# EAGLE design Bus_Isolator (EAGLE 6.6.0)
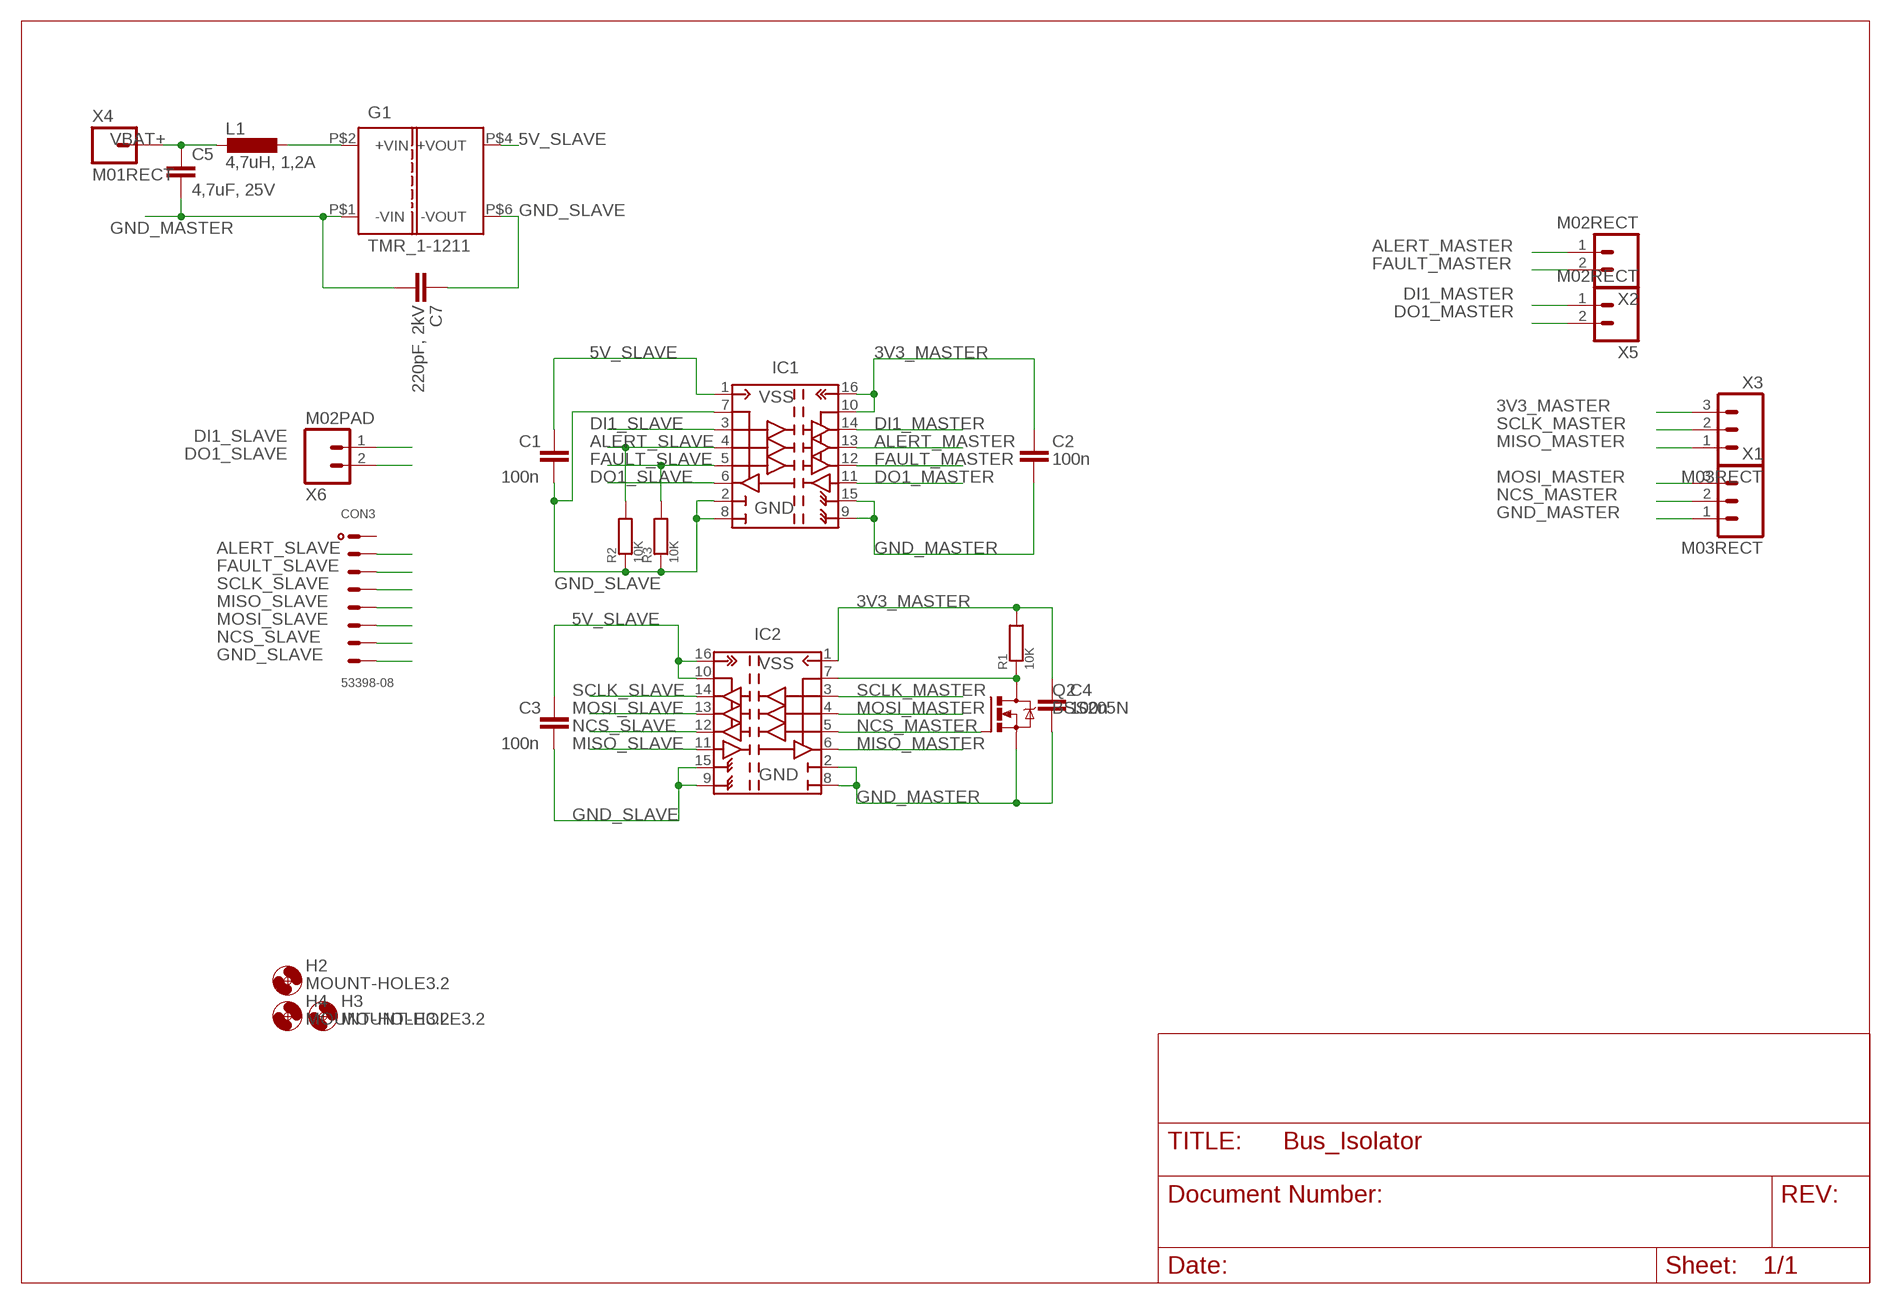
[diagram p0: schematic, sheet 1]

## Parts
C1  100n  CSTD  [C0805]
C2  100n  CSTD  [C0805]
C3  100n  CSTD  [C0805]
C4  100n  CSTD  [C0805]
C5  4,7uF, 25V  C-EUC0805  [C0805]
C7  220pF, 2kV  CC1210_HV  [C1210_HV]
CON3  53398-08  [53398-08]
G1  TMR_1-1211  TMR_1-1  [TMR_1-??1?]
H2  MOUNT-HOLE3.2  [3,2]
H3  MOUNT-HOLE3.2  [3,2]
H4  MOUNT-HOLE3.2  [3,2]
IC1  ISO7241  [R-PDSO-G16]
IC2  ISO7241  [R-PDSO-G16]
L1  4,7uH, 1,2A  L-EUL3225M  [L3225M]
Q2  BSS205N  [SOT23]
R1  10K  R0603  [R0603]
R2  10K  R  [R0805]
R3  10K  R  [R0805]
X1  M03RECT  [1X03_RECT]
X2  M02RECT  [1X02_RECT]
X3  M03RECT  [1X03_RECT]
X4  M01RECT  [1X01_RECT]
X5  M02RECT  [1X02_RECT]
X6  M02PAD  [1X02]

## Nets
3V3_MASTER: C2.2 C4.2 IC1.10(EN2) IC1.16(VCC2) IC2.1(VCC1) R1.2 X3.3
5V_SLAVE: C1.2 C3.2 G1.P$4(+VOUT) IC1.1(VCC1) IC2.10(EN2) IC2.16(VCC2)
ALERT_MASTER: IC1.13(OUT_B) X2.1
ALERT_SLAVE: CON3.2 IC1.4(IN_B) R2.2
DI1_MASTER: IC1.14(OUT_A) X5.1
DI1_SLAVE: IC1.3(IN_A) X6.1
DO1_MASTER: IC1.11(IN_D) X5.2
DO1_SLAVE: IC1.6(OUT_D) X6.2
FAULT_MASTER: IC1.12(OUT_C) X2.2
FAULT_SLAVE: CON3.3 IC1.5(IN_C) R3.2
GND_MASTER: C2.1 C4.1 C5.2 C7.P$1 G1.P$1(-VIN) IC1.9(GND22) IC1.15(GND21) IC2.2(GND11) IC2.8(GND12) Q2.2(S) X1.1
GND_SLAVE: C1.1 C3.1 C7.P$2 CON3.8 G1.P$6(-VOUT) IC1.2(GND11) IC1.7(EN1) IC1.8(GND12) IC2.9(GND22) IC2.15(GND21) R2.1 R3.1
MISO_MASTER: IC2.6(OUT_D) X3.1
MISO_SLAVE: CON3.5 IC2.11(IN_D)
MOSI_MASTER: IC2.4(IN_B) X1.3
MOSI_SLAVE: CON3.6 IC2.13(OUT_B)
N$2: IC2.7(EN1) Q2.3(D) R1.1
N$5: G1.P$2(+VIN) L1.1
NCS_MASTER: IC2.5(IN_C) Q2.1(G) X1.2
NCS_SLAVE: CON3.7 IC2.12(OUT_C)
SCLK_MASTER: IC2.3(IN_A) X3.2
SCLK_SLAVE: CON3.4 IC2.14(OUT_A)
VBAT+: C5.1 L1.2 X4.1
Unconnected: CON3.1

## Library data of the parts
C1-C4 C7 = useful:C
C5 = rcl:C-EU: CAPACITOR, European symbol
CON3 = con-molex:53?-08: CONNECTOR wire to board 1.25 mm (.049 inch) pitch header
G1 = traco-power:TMR_1-??1?
H2-H4 = holes:MOUNT-HOLE: MOUNTING HOLE with drill center marker
IC1 IC2 = ti:ISO7241
L1 = rcl:L-EU: INDUCTOR, European symbol
Q2 = infineon:BSS205N: Infineon Small Signal Transistor, OptiMOS 2 Technology, 20V, 2.5A SOT23
R1-R3 = useful:R
X1 X3 = stiftleisten:M03
X2 X5 X6 = stiftleisten:M02
X4 = stiftleisten:M01

## Board
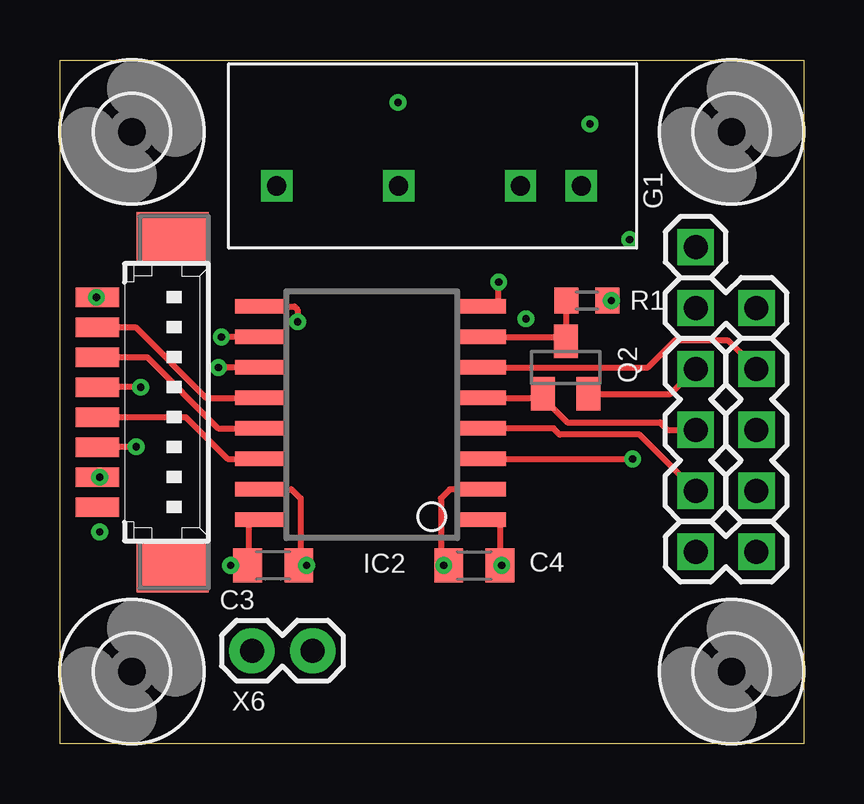
[diagram p1: board, top side]
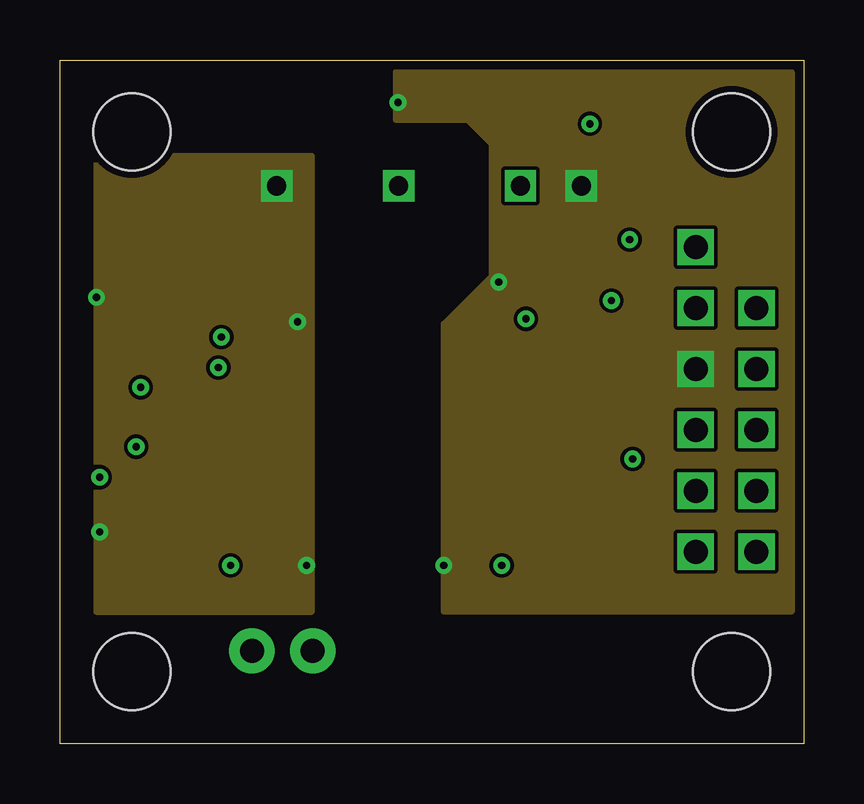
[diagram p2: board, inner layer Route2]
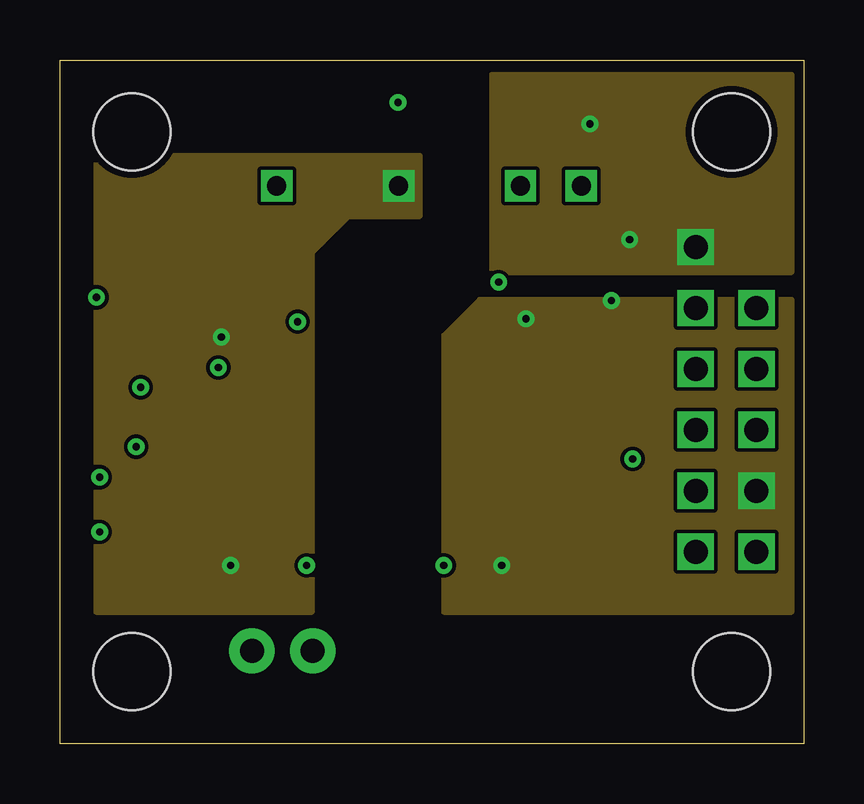
[diagram p3: board, inner layer Route15]
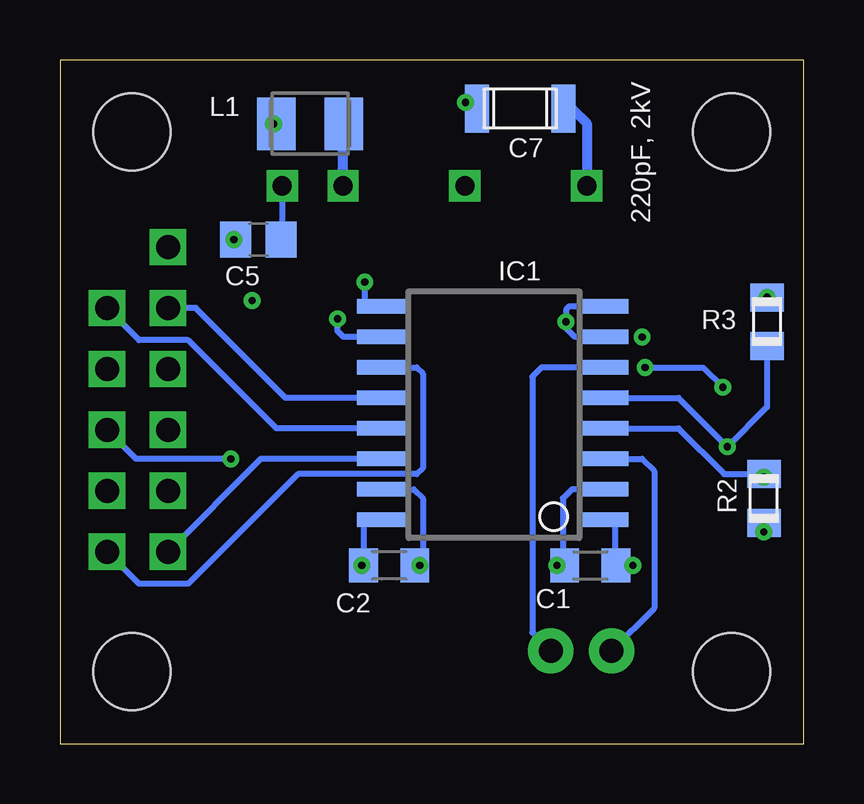
[diagram p4: board, bottom side, seen from below]

Size 31 x 28.5 mm. Coordinates in mm from the lower left corner, seen from the top.
Outline: 0,28.5 31,28.5 31,0 0,0 0,28.5
Copper layers (1+2*15+16): Top 0.035mm / dielectric 0.2mm / Route2 0.035mm / dielectric 0.5mm / Route15 0.035mm / dielectric 0.2mm / Bottom 0.035mm
Design rules "ats_35u_4layer": minimum track width 6mil, minimum drill 0.2mm, track to track 6mil, track to pad 6mil, pad to pad 6mil, via to via 6mil, smd to smd 6mil, copper to edge 0.3mm, drill to drill 8mil, minimum pad ring 10mil, minimum via ring 0.2mm, stop-mask expansion 4mil, vias tented up to drill 0mil, thermal gap 10mil

### Footprints (pad centres in the part's own frame; a part is rotated, then mirrored left to right if it is on the bottom)
C0805 = smd 1.2 x 1.4: 1 -1.066,0; 2 1.066,0
C0805' = smd 1.3 x 1.5: 1 -0.95,0; 2 0.95,0
C1210_HV = smd 1 x 2: P$1 -1.8,0; P$2 1.8,0
53398-08 = smd 0.8 x 1.8: 1 4.375,-2.5; 2 3.125,-2.5; 3 1.875,-2.5; 4 0.625,-2.5; 5 -0.625,-2.5; 6 -1.875,-2.5; 7 -3.125,-2.5; 8 -4.375,-2.5 | smd 2.1 x 3: S1 6.875,0.625; S2 -6.875,0.625
TMR_1-??1? = drill 0.8 square: P$1 0,0; P$2 2.54,0; P$4 7.62,0; P$6 12.7,0
3,2 = hole 3.2: 0,0
R-PDSO-G16 = smd 0.6 x 2: 1 -3.937,-4.649; 2 -2.667,-4.649; 3 -1.397,-4.649; 4 -0.127,-4.649; 5 1.143,-4.649; 6 2.413,-4.649; 7 3.683,-4.649; 8 4.953,-4.649; 9 4.953,4.651; 10 3.683,4.651; 11 2.413,4.651; 12 1.143,4.651; 13 -0.127,4.651; 14 -1.397,4.651; 15 -2.667,4.651; 16 -3.937,4.651
L3225M = smd 1.6 x 2.2: 1 -1.4,0; 2 1.4,0
SOT23 = smd 1 x 1.4: 1 -0.95,-1.1; 2 0.95,-1.1; 3 0,1.1
R0603 = smd 1 x 1.1: 1 -0.85,0; 2 0.85,0
R0805 = smd 1.168 x 1.397: 1 -1.016,0; 2 1.016,0
1X03_RECT = drill 1 square: 1 0,0; 2 2.54,0; 3 5.08,0
1X02_RECT = drill 1 square: 1 0,0; 2 2.54,0
1X01_RECT = drill 1 square: 1 0,0
1X02 = drill 1 pad 1.88: 1 0,0; 2 2.54,0

### Placement (x,y rotation side)
C1  8.89,7.43 0 bottom
C2  17.27,7.43 180 bottom
C3  8.89,7.43 180 top
C4  17.27,7.43 0 top
C5  4,7uF, 25V  [C0805']  22.73,21.01 0 bottom
C7  11.81,26.47 0 bottom
CON3  4.06,14.23 270 top
G1  21.74,23.25 180 top
H1  MOUNT-HOLE3.2  [3,2]  28,3 0 top
H2  28,25.5 0 top
H3  3,3 0 top
H4  3,25.5 0 top
IC1  12.95,13.27 90 bottom
IC2  12.95,13.27 90 top
L1  20.57,25.84 180 bottom
Q2  21.09,15.68 0 top
R1  21.97,18.47 0 top
R2  1.65,10.22 90 bottom
R3  1.52,17.59 270 bottom
X1  26.5,15.62 270 top
X2  29.04,18.16 180 top
X3  29.04,15.62 270 top
X4  26.5,20.7 0 top
X5  26.5,8 0 top
X6  8,3.87 0 top

### Tracks (layer width: path | path; a pad name or v marks a point on that pad's centre or on a via)
3V3_MASTER  (via drill 0.3)
  Top 0.254: v18.41,7.43 C4.2 18.34,9.33 IC2.1 | R1.2 v22.99,18.47
  Bottom 0.254: v18.41,7.43 C4.2 18.34,9.33 IC1.16 | IC1.10 19.18,16.95 19.43,17.2 v19.43,17.71
  pour Route15 (no thermals): 16,5.5 30.5,5.5 30.5,18.5 17.5,18.5 16,17
5V_SLAVE  (via drill 0.3)
  Top 0.254: v7.11,7.43 C3.2 7.82,7.5 7.87,7.55 7.87,9.33 IC1.1 | IC2.10 v6.73,16.95
  Bottom 0.254: IC1.1 7.87,9.33 7.87,7.43 C3.2 v7.11,7.43
  pour Route15 (no thermals): 15,24.5 1.5,24.5 1.5,5.5 10.5,5.5 10.5,20.5 12,22 15,22
ALERT_MASTER
  Bottom 0.254: IC1.13 21.98,13.14 25.65,16.82 27.7,16.82 X2.1
ALERT_SLAVE  (via drill 0.3)
  Top 0.254: 1.4,11.1 v1.65,11.1 CON3.2
  Bottom 0.254: IC1.4 5.21,13.14 3.31,11.24 R2.2 v1.65,11.1
DI1_MASTER
  Bottom 0.254: IC1.14 22.63,11.87 X5.1
DI1_SLAVE
  Bottom 0.254: IC1.3 6.74,11.87 6.22,11.36 6.22,5.64 X6.1
DO1_MASTER
  Bottom 0.254: IC1.11 16.13,15.68 15.88,15.42 15.88,11.49 16.13,11.23 21.08,11.23 25.65,6.66 27.7,6.66 X5.2
DO1_SLAVE
  Bottom 0.254: IC1.6 10.92,15.68 11.3,15.3 11.3,4.63 X6.2
FAULT_MASTER
  Bottom 0.254: IC1.12 21.59,14.41 25.34,18.16 X2.2
FAULT_SLAVE  (via drill 0.3)
  Top 0.254: v3.17,12.38 1.58,12.38 CON3.3
  Bottom 0.254: IC1.5 5.21,14.41 v3.17,12.38 1.52,14.03 R3.2
GND_MASTER  (via drill 0.3)
  Top 0.254: v16,7.43 C4.1 15.75,7.43 15.88,7.55 15.88,10.22 16.26,10.6 IC2.2 | IC2.8 18.29,18.22 v18.29,19.24 | Q2.2 25.46,14.58 X1.1
  Bottom 0.254: v16,7.43 C4.1 15.75,7.43 15.88,7.55 15.88,10.22 16.26,10.6 IC1.15 | IC1.9 18.29,18.22 v18.29,19.24 | G1.P$1 21.74,21.06 C5.2
  Bottom 0.406: C7.P$1 13.84,26.47 v14.1,26.73
  pour Route2 (no thermals): 16,5.5 16,17.5 18,19.5 18,25 17,26 14,26 14,28 30.5,28 30.5,5.5
GND_SLAVE  (via drill 0.3)
  Top 0.254: v10.29,7.43 C1.1 10.03,7.5 10.03,10.22 9.65,10.6 IC1.2 | CON3.8 R3.1 | IC1.8 9.78,18.22 9.91,18.09 v9.91,17.59
  Bottom 0.254: IC1.2 9.65,10.6 10.03,10.22 10.03,7.5 C1.1 v10.29,7.43 | R2.1 v1.65,8.82 | IC1.7 9.53,16.95 9.91,17.33 v9.91,17.59 9.91,18.09 9.78,18.22 IC1.8
  Bottom 0.406: G1.P$6 9.04,25.86 9.65,26.47 C7.P$2
  other vias: 1.52,18.6
  pour Route2 (no thermals): 10.5,24.5 1.5,24.5 1.5,5.5 10.5,5.5
MISO_MASTER
  Top 0.254: IC2.6 24.52,15.68 25.65,16.82 27.84,16.82 X3.1
MISO_SLAVE  (via drill 0.3)
  Top 0.254: IC2.11 v6.6,15.68 | v3.37,14.85 CON3.5
  Bottom 0.254: v6.6,15.68 4.19,15.68 v3.37,14.85
MOSI_MASTER
  Top 0.254: X1.3 24.16,12.88 20.83,12.88 20.57,13.14 IC2.4 17.73,13.01
MOSI_SLAVE
  Top 0.254: CON3.6 3.64,16.1 6.6,13.14 IC2.13
N$2
  Top 0.254: IC2.7 21.09,16.95 Q2.3 21.12,16.78 R1.1
N$5
  Bottom 0.406: G1.P$2 19.2,25.81 L1.1
NCS_MASTER
  Top 0.254: IC2.5 20.14,14.41 | 20.14,14.41 Q2.1 | 20.14,14.41 21.16,13.39 25.02,13.39 25.33,13.08 X1.2
NCS_SLAVE
  Top 0.254: CON3.7 3.15,17.35 6.1,14.41 IC2.12
SCLK_MASTER  (via drill 0.3)
  Top 0.254: IC2.3 v23.87,11.87 v23.88,11.87
  Bottom 0.254: v23.88,11.87 27.83,11.87 X3.2
SCLK_SLAVE
  Top 0.254: CON3.4 5.25,13.6 6.99,11.87 IC2.14
VBAT+  (via drill 0.3)
  Bottom 0.254: C5.1 v23.75,21.01
  Bottom 0.406: L1.2 v22.1,25.84
  pour Route15 (no thermals): 18,27.86 18,19.66 30.5,19.66 30.5,27.86

### Text on the board
tTest: SPI Isolator V4 | TERA TU Graz | Pöschl
bTest: SPI Isolator V4 | TERA TU Graz